# Altium schematic sheet Sheet_Shield.SchDoc
size A4
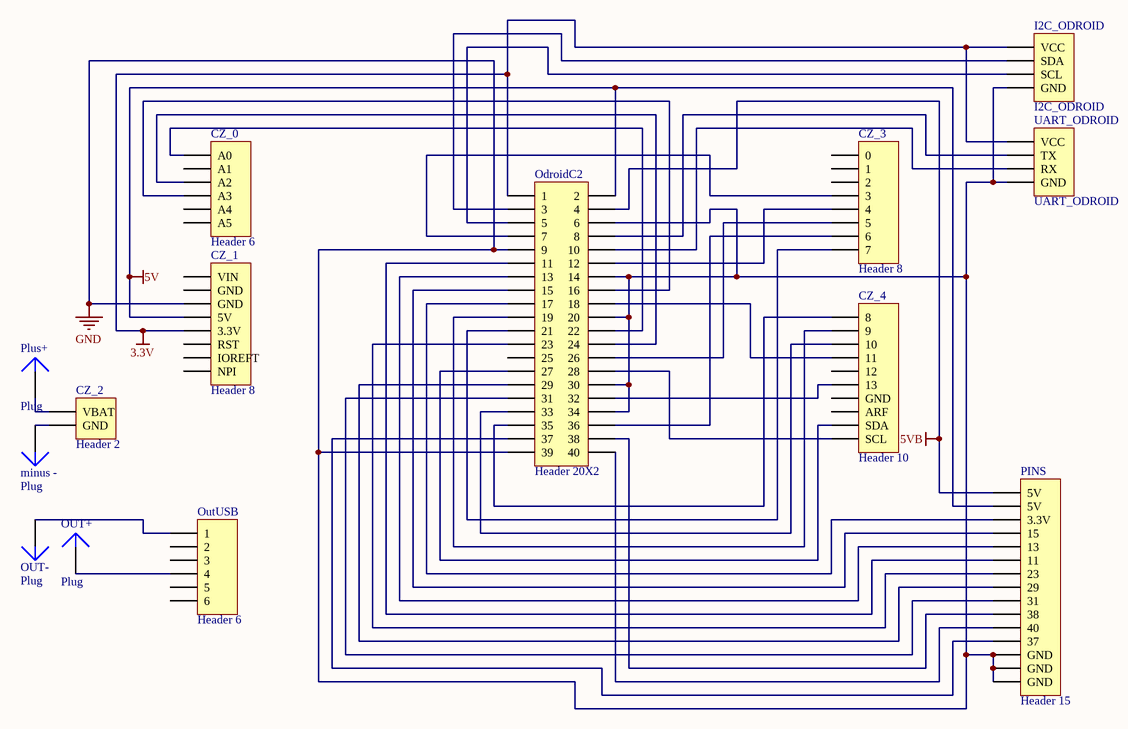
[diagram p0: Sheet_Shield.SchDoc]

## Parts
CZ_0  Header 6  [HDR1X6]
CZ_1  Header 8  [HDR1X8]
CZ_2  Header 2  [HDR1X2]
CZ_3  Header 8  [HDR1X8]
CZ_4  Header 10  [HDR1X10]
I2C_ODROID  I2C_ODROID  [HDR1X4]
minus_-  Plug  [PIN1]
OdroidC2  Header 20X2  [HDR2X20]
OUT+  Plug  [PIN1]
OUT-  Plug  [PIN1]
OutUSB  Header 6  [USB2.5-2H4C]
PINS  Header 15  [HDR1X15]
Plus+  Plug  [PIN1]
UART_ODROID  UART_ODROID  [HDR1X4]

## Nets
3.3V: CZ_1.5(3.3V) I2C_ODROID.1(VCC) OdroidC2.1 UART_ODROID.1(VCC)
5V: CZ_1.4(5V) OdroidC2.2 PINS.2(5V)
5VB: OdroidC2.4 PINS.1(5V)
GND: CZ_1.3(GND) I2C_ODROID.4(GND) OdroidC2.6 OdroidC2.9 OdroidC2.14 OdroidC2.20 OdroidC2.30 OdroidC2.34 OdroidC2.39 PINS.13(GND) PINS.14(GND) PINS.15(GND) UART_ODROID.4(GND)
NetCZ_0_1: CZ_0.1(A0) OdroidC2.22
NetCZ_0_3: CZ_0.3(A2) OdroidC2.24
NetCZ_0_4: CZ_0.4(A3) OdroidC2.16
NetCZ_2_1: CZ_2.1(VBAT) Plus+.1
NetCZ_2_2: CZ_2.2(GND) minus_-.1
NetCZ_3_4: CZ_3.4(3) OdroidC2.7
NetCZ_3_5: CZ_3.5(4) OdroidC2.12
NetCZ_3_6: CZ_3.6(5) OdroidC2.26
NetCZ_3_7: CZ_3.7(6) OdroidC2.36
NetCZ_3_8: CZ_3.8(7) OdroidC2.21
NetCZ_4_1: CZ_4.1(8) OdroidC2.35
NetCZ_4_2: CZ_4.2(9) OdroidC2.19
NetCZ_4_3: CZ_4.3(10) OdroidC2.33
NetCZ_4_4: CZ_4.4(11) OdroidC2.18
NetCZ_4_6: CZ_4.6(13) OdroidC2.32
NetCZ_4_9: CZ_4.9(SDA) OdroidC2.27
NetCZ_4_10: CZ_4.10(SCL) OdroidC2.28
NetI2C_ODROID_2: I2C_ODROID.2(SDA) OdroidC2.3
NetI2C_ODROID_3: I2C_ODROID.3(SCL) OdroidC2.5
NetOdroidC2_8: OdroidC2.8 UART_ODROID.2(TX)
NetOdroidC2_10: OdroidC2.10 UART_ODROID.3(RX)
NetOdroidC2_11: OdroidC2.11 PINS.6(11)
NetOdroidC2_13: OdroidC2.13 PINS.5(13)
NetOdroidC2_15: OdroidC2.15 PINS.4(15)
NetOdroidC2_17: OdroidC2.17 PINS.3(3.3V)
NetOdroidC2_23: OdroidC2.23 PINS.7(23)
NetOdroidC2_29: OdroidC2.29 PINS.8(29)
NetOdroidC2_31: OdroidC2.31 PINS.9(31)
NetOdroidC2_37: OdroidC2.37 PINS.12(37)
NetOdroidC2_38: OdroidC2.38 PINS.10(38)
NetOdroidC2_40: OdroidC2.40 PINS.11(40)
NetOUT+_1: OUT+.1 OutUSB.4
NetOUT-_1: OUT-.1 OutUSB.1

Not connected (* = marked no-connect by the designer): CZ_0 2(A1) 5(A4) 6(A5); CZ_1 1(VIN) 2(GND) 6(RST) 7(IOREFT) 8(NPI); CZ_3 1(0) 2(1) 3(2); CZ_4 5(12) 7(GND) 8(ARF); OdroidC2 25; OutUSB 2 3 5 6

## Library data of the parts
CZ_0 OutUSB = Header 6: Header, 6-Pin; LatestRevisionDate: 17-Jul-2002; LatestRevisionNote: Re-released for DXP Platform.; Publisher: Altium Limited
CZ_1 CZ_3 = Header 8: Header, 8-Pin; LatestRevisionDate: 17-Jul-2002; LatestRevisionNote: Re-released for DXP Platform.; Publisher: Altium Limited
CZ_2 = Header 2: Header, 2-Pin; LatestRevisionDate: 17-Jul-2002; LatestRevisionNote: Re-released for DXP Platform.; Publisher: Altium Limited
CZ_4 = Header 10: Header, 10-Pin; LatestRevisionDate: 17-Jul-2002; LatestRevisionNote: Re-released for DXP Platform.; Publisher: Altium Limited
I2C_ODROID UART_ODROID = Header 4: Header, 4-Pin; LatestRevisionDate: 17-Jul-2002; LatestRevisionNote: Re-released for DXP Platform.; Publisher: Altium Limited
OdroidC2 = Header 20X2: Header, 20-Pin, Dual row; LatestRevisionDate: 17-Jul-2002; LatestRevisionNote: Re-released for DXP Platform.; Publisher: Altium Limited
PINS = Header 15: Header, 15-Pin; LatestRevisionDate: 17-Jul-2002; LatestRevisionNote: Re-released for DXP Platform.; Publisher: Altium Limited
minus_- OUT+ OUT- Plus+ = Plug: LatestRevisionDate: 17-Jul-2002; LatestRevisionNote: Re-released for DXP Platform.; Publisher: Altium Limited